# Altium schematic sheet Conn_A.SchDoc
size A1
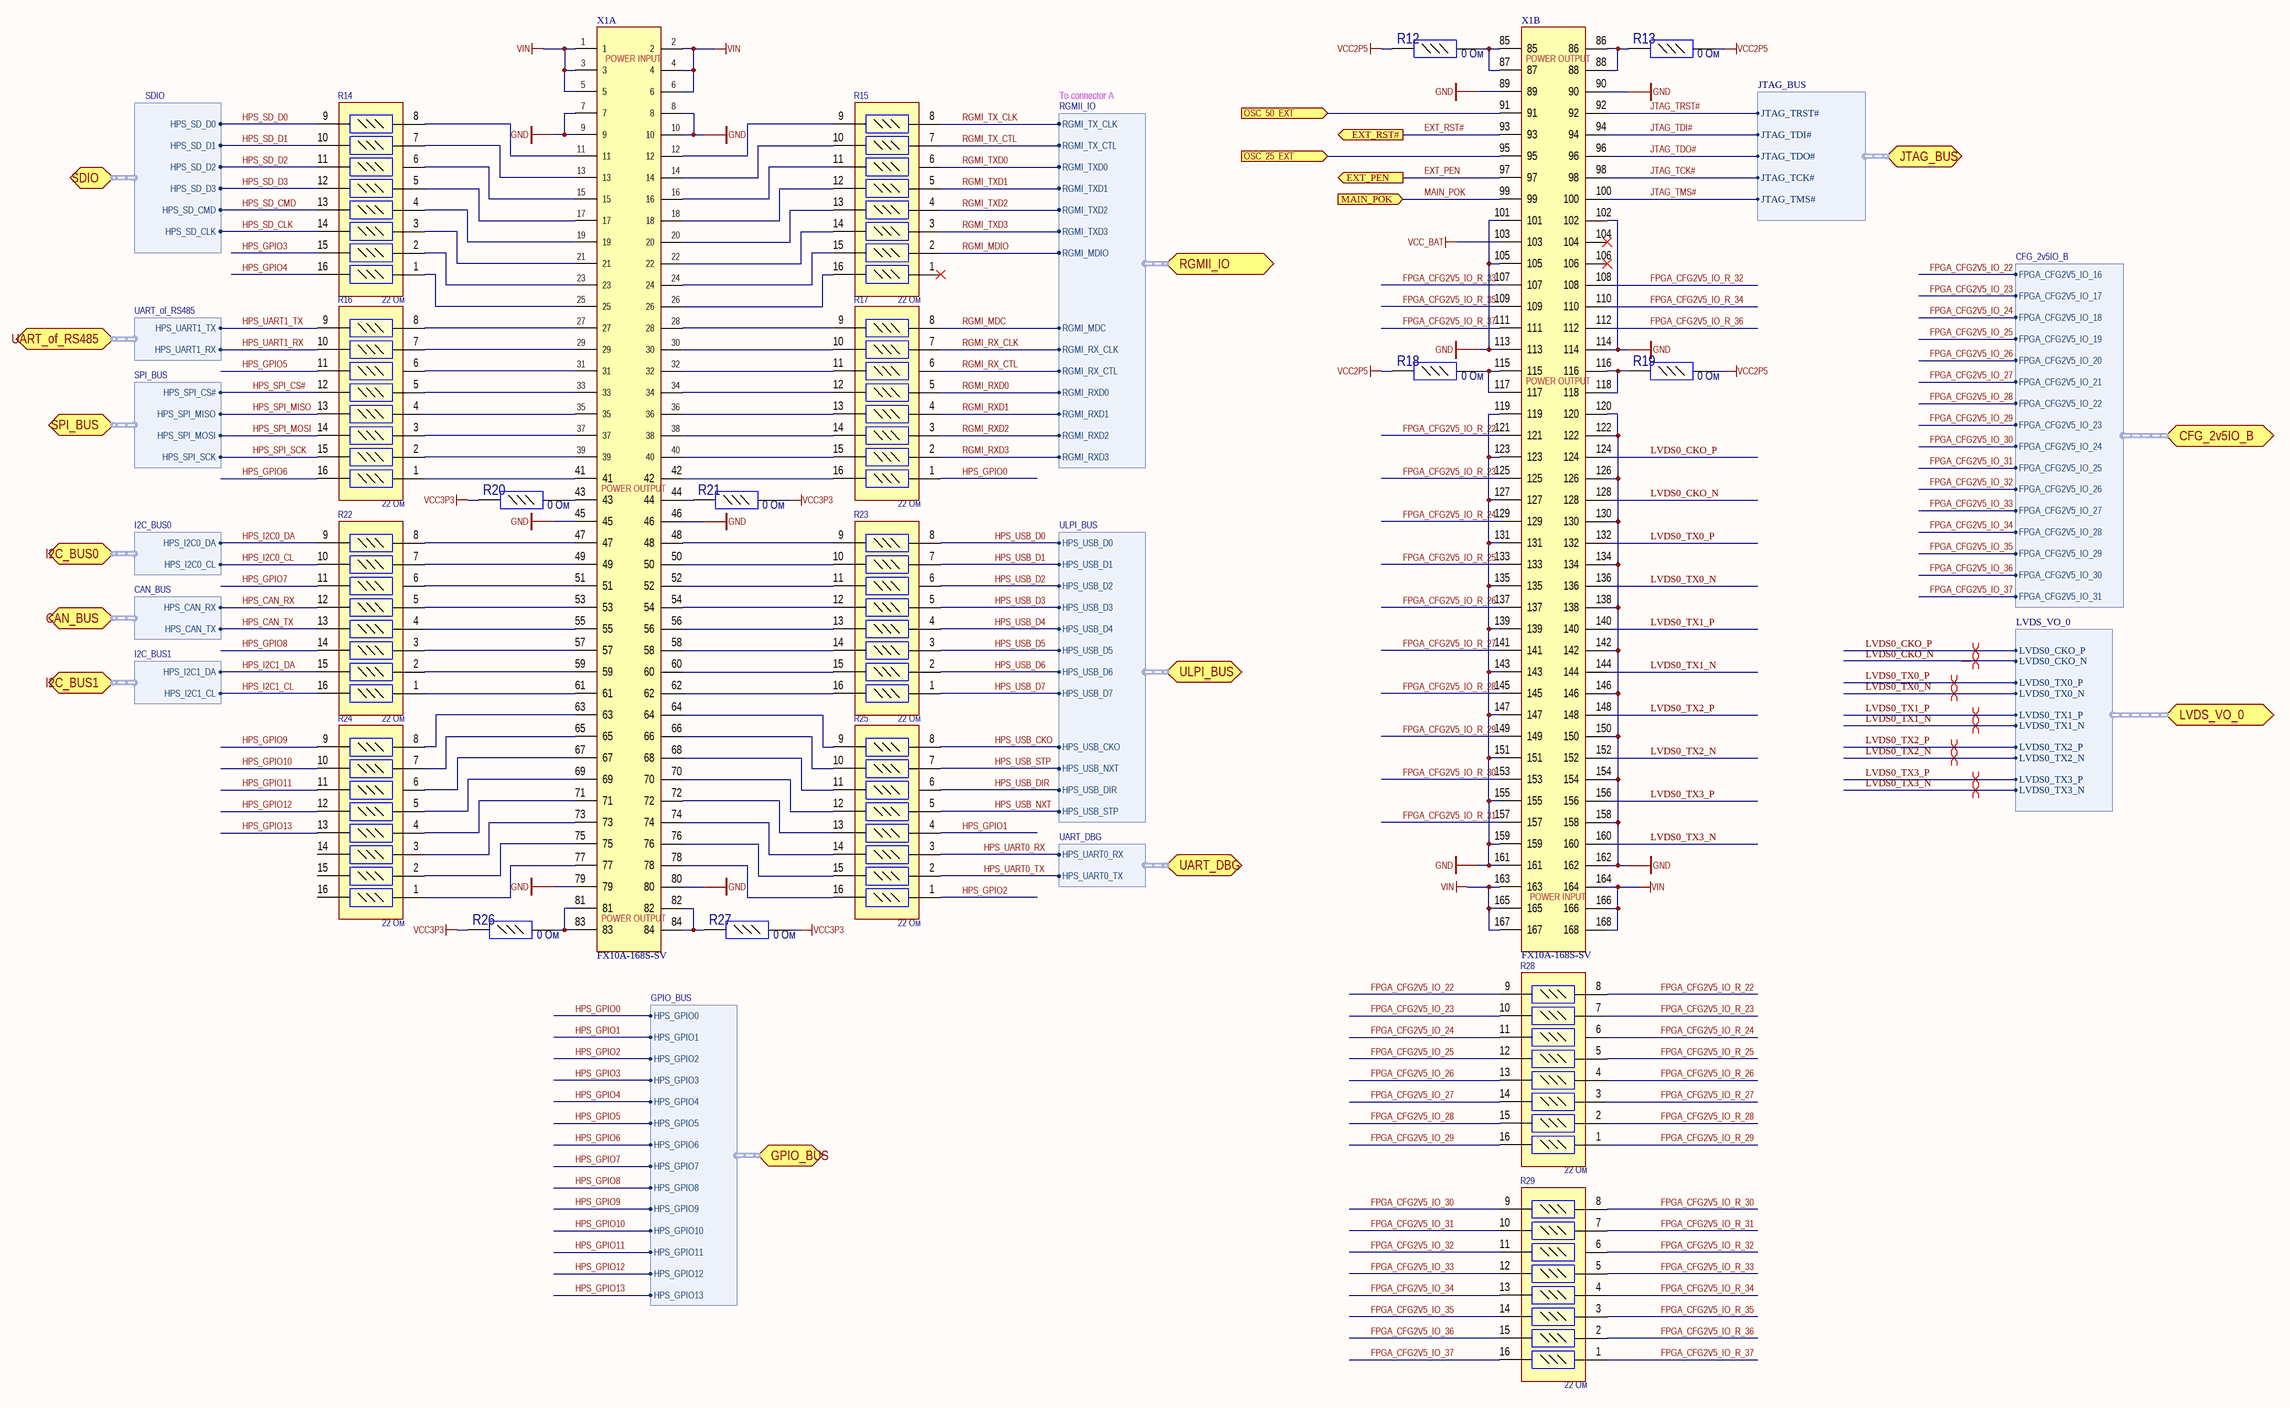
[diagram p0: Conn_A.SchDoc]

## Parts
R12  value 0 Ом  [CR0603]  (hidden comment: CR0603-0 Ом-±5%)
R13  value 0 Ом  [CR0603]  (hidden comment: CR0603-0 Ом-±5%)
R14  value 22 Ом  [CAT16-J8]  (hidden comment: YC248-JR-07-22 Ом)
R15  value 22 Ом  [CAT16-J8]  (hidden comment: YC248-JR-07-22 Ом)
R16  value 22 Ом  [CAT16-J8]  (hidden comment: YC248-JR-07-22 Ом)
R17  value 22 Ом  [CAT16-J8]  (hidden comment: YC248-JR-07-22 Ом)
R18  value 0 Ом  [CR0603]  (hidden comment: CR0603-0 Ом-±5%)
R19  value 0 Ом  [CR0603]  (hidden comment: CR0603-0 Ом-±5%)
R20  value 0 Ом  [CR0603]  (hidden comment: CR0603-0 Ом-±5%)
R21  value 0 Ом  [CR0603]  (hidden comment: CR0603-0 Ом-±5%)
R22  value 22 Ом  [CAT16-J8]  (hidden comment: YC248-JR-07-22 Ом)
R23  value 22 Ом  [CAT16-J8]  (hidden comment: YC248-JR-07-22 Ом)
R24  value 22 Ом  [CAT16-J8]  (hidden comment: YC248-JR-07-22 Ом)
R25  value 22 Ом  [CAT16-J8]  (hidden comment: YC248-JR-07-22 Ом)
R26  value 0 Ом  [CR0603]  (hidden comment: CR0603-0 Ом-±5%)
R27  value 0 Ом  [CR0603]  (hidden comment: CR0603-0 Ом-±5%)
R28  value 22 Ом  [CAT16-J8]  (hidden comment: YC248-JR-07-22 Ом)
R29  value 22 Ом  [CAT16-J8]  (hidden comment: YC248-JR-07-22 Ом)
X1  FX10A-168S-SV  [FX10A-168S-SV]  (parts A,B of 2)

## Ports
CAN_BUS (harness CAN_BUS), CFG_2v5IO_B (harness CFG_2v5IO_B), EXT_PEN (out), EXT_RST# (out), GPIO_BUS (harness GPIO_BUS), I2C_BUS0 (harness I2C_BUS0), I2C_BUS1 (harness I2C_BUS1), JTAG_BUS (harness JTAG_BUS), LVDS_VO_0 (harness LVDS_VO_0), MAIN_POK (in), OSC_25_EXT (in), OSC_50_EXT (in), RGMII_IO (harness RGMII_IO), SDIO (harness SDIO), SPI_BUS (harness SPI_BUS), UART_DBG (harness UART_DBG), UART_of_RS485 (harness UART_of_RS485), ULPI_BUS (harness ULPI_BUS)

## Harnesses
LVDS_VO_0: LVDS0_CKO_P, LVDS0_CKO_N, LVDS0_TX0_P, LVDS0_TX0_N, LVDS0_TX1_P, LVDS0_TX1_N, LVDS0_TX2_P, LVDS0_TX2_N, LVDS0_TX3_P, LVDS0_TX3_N
JTAG_BUS: JTAG_TRST#, JTAG_TDI#, JTAG_TDO#, JTAG_TCK#, JTAG_TMS#
SDIO: HPS_SD_D0, HPS_SD_D1, HPS_SD_D2, HPS_SD_D3, HPS_SD_CMD, HPS_SD_CLK
ULPI_BUS: HPS_USB_D0, HPS_USB_D1, HPS_USB_D2, HPS_USB_D3, HPS_USB_D4, HPS_USB_D5, HPS_USB_D6, HPS_USB_D7, HPS_USB_CKO, HPS_USB_NXT, HPS_USB_DIR, HPS_USB_STP
UART_DBG: HPS_UART0_RX, HPS_UART0_TX
UART_of_RS485: HPS_UART1_RX, HPS_UART1_TX
GPIO_BUS: HPS_GPIO0, HPS_GPIO1, HPS_GPIO2, HPS_GPIO3, HPS_GPIO4, HPS_GPIO5, HPS_GPIO6, HPS_GPIO7, HPS_GPIO8, HPS_GPIO9, HPS_GPIO10, HPS_GPIO11, HPS_GPIO12, HPS_GPIO13
SPI_BUS: HPS_SPI_MOSI, HPS_SPI_MISO, HPS_SPI_SCK, HPS_SPI_CS#
I2C_BUS0: HPS_I2C0_DA, HPS_I2C0_CL
I2C_BUS1: HPS_I2C1_DA, HPS_I2C1_CL
CAN_BUS: HPS_CAN_TX, HPS_CAN_RX
RGMII_IO: RGMI_TX_CLK, RGMI_TXD0, RGMI_TXD1, RGMI_TXD2, RGMI_TXD3, RGMI_RXD0, RGMI_RXD1, RGMI_RXD2, RGMI_RXD3, RGMI_TX_CTL, RGMI_RX_CTL, RGMI_RX_CLK, RGMI_MDIO, RGMI_MDC
CFG_2v5IO_B: FPGA_CFG2V5_IO_16, FPGA_CFG2V5_IO_17, FPGA_CFG2V5_IO_18, FPGA_CFG2V5_IO_19, FPGA_CFG2V5_IO_20, FPGA_CFG2V5_IO_21, FPGA_CFG2V5_IO_22, FPGA_CFG2V5_IO_23, FPGA_CFG2V5_IO_24, FPGA_CFG2V5_IO_25, FPGA_CFG2V5_IO_26, FPGA_CFG2V5_IO_27, FPGA_CFG2V5_IO_28, FPGA_CFG2V5_IO_29, FPGA_CFG2V5_IO_30, FPGA_CFG2V5_IO_31

## Nets
GND: X1.7 X1.8 X1.9 X1.10 X1.45 X1.46 X1.79 X1.80 X1.89 X1.90 X1.101 X1.102 X1.105 X1.113 X1.114 X1.119 X1.120 X1.122 X1.123 X1.126 X1.127 X1.130 X1.131 X1.134 X1.135 X1.138 X1.139 X1.142 X1.143 X1.146 X1.147 X1.150 X1.151 X1.154 X1.155 X1.158 X1.159 X1.161 X1.162
VCC2P5: R12.1(+) R13.2(-) R18.1(+) R19.2(-)
VCC3P3: R20.1(+) R21.2(-) R26.1(+) R27.2(-)
VCC_BAT: X1.103
VIN: X1.1 X1.2 X1.3 X1.4 X1.5 X1.6 X1.163 X1.164 X1.165 X1.166 X1.167 X1.168
EXT_PEN: X1.97 ; port EXT_PEN
EXT_RST#: X1.93 ; port EXT_RST#
FPGA_CFG2V5_IO_22: R28.9 ; port CFG_2v5IO_B.FPGA_CFG2V5_IO_16
FPGA_CFG2V5_IO_23: R28.10 ; port CFG_2v5IO_B.FPGA_CFG2V5_IO_17
FPGA_CFG2V5_IO_24: R28.11 ; port CFG_2v5IO_B.FPGA_CFG2V5_IO_18
FPGA_CFG2V5_IO_25: R28.12 ; port CFG_2v5IO_B.FPGA_CFG2V5_IO_19
FPGA_CFG2V5_IO_26: R28.13 ; port CFG_2v5IO_B.FPGA_CFG2V5_IO_20
FPGA_CFG2V5_IO_27: R28.14 ; port CFG_2v5IO_B.FPGA_CFG2V5_IO_21
FPGA_CFG2V5_IO_28: R28.15 ; port CFG_2v5IO_B.FPGA_CFG2V5_IO_22
FPGA_CFG2V5_IO_29: R28.16 ; port CFG_2v5IO_B.FPGA_CFG2V5_IO_23
FPGA_CFG2V5_IO_30: R29.9 ; port CFG_2v5IO_B.FPGA_CFG2V5_IO_24
FPGA_CFG2V5_IO_31: R29.10 ; port CFG_2v5IO_B.FPGA_CFG2V5_IO_25
FPGA_CFG2V5_IO_32: R29.11 ; port CFG_2v5IO_B.FPGA_CFG2V5_IO_26
FPGA_CFG2V5_IO_33: R29.12 ; port CFG_2v5IO_B.FPGA_CFG2V5_IO_27
FPGA_CFG2V5_IO_34: R29.13 ; port CFG_2v5IO_B.FPGA_CFG2V5_IO_28
FPGA_CFG2V5_IO_35: R29.14 ; port CFG_2v5IO_B.FPGA_CFG2V5_IO_29
FPGA_CFG2V5_IO_36: R29.15 ; port CFG_2v5IO_B.FPGA_CFG2V5_IO_30
FPGA_CFG2V5_IO_37: R29.16 ; port CFG_2v5IO_B.FPGA_CFG2V5_IO_31
FPGA_CFG2V5_IO_R_22: R28.8 X1.121
FPGA_CFG2V5_IO_R_23: R28.7 X1.125
FPGA_CFG2V5_IO_R_24: R28.6 X1.129
FPGA_CFG2V5_IO_R_25: R28.5 X1.133
FPGA_CFG2V5_IO_R_26: R28.4 X1.137
FPGA_CFG2V5_IO_R_27: R28.3 X1.141
FPGA_CFG2V5_IO_R_28: R28.2 X1.145
FPGA_CFG2V5_IO_R_29: R28.1 X1.149
FPGA_CFG2V5_IO_R_30: R29.8 X1.153
FPGA_CFG2V5_IO_R_31: R29.7 X1.157
FPGA_CFG2V5_IO_R_32: R29.6 X1.108
FPGA_CFG2V5_IO_R_33: R29.5 X1.107
FPGA_CFG2V5_IO_R_34: R29.4 X1.110
FPGA_CFG2V5_IO_R_35: R29.3 X1.109
FPGA_CFG2V5_IO_R_36: R29.2 X1.112
FPGA_CFG2V5_IO_R_37: R29.1 X1.111
HPS_CAN_RX: R22.12 ; port CAN_BUS.HPS_CAN_RX
HPS_CAN_TX: R22.13 ; port CAN_BUS.HPS_CAN_TX
HPS_GPIO0: R17.1 ; port GPIO_BUS.HPS_GPIO0
HPS_GPIO1: R25.4 ; port GPIO_BUS.HPS_GPIO1
HPS_GPIO2: R25.1 ; port GPIO_BUS.HPS_GPIO2
HPS_GPIO3: R14.15 ; port GPIO_BUS.HPS_GPIO3
HPS_GPIO4: R14.16 ; port GPIO_BUS.HPS_GPIO4
HPS_GPIO5: R16.11 ; port GPIO_BUS.HPS_GPIO5
HPS_GPIO6: R16.16 ; port GPIO_BUS.HPS_GPIO6
HPS_GPIO7: R22.11 ; port GPIO_BUS.HPS_GPIO7
HPS_GPIO8: R22.14 ; port GPIO_BUS.HPS_GPIO8
HPS_GPIO9: R24.9 ; port GPIO_BUS.HPS_GPIO9
HPS_GPIO10: R24.10 ; port GPIO_BUS.HPS_GPIO10
HPS_GPIO11: R24.11 ; port GPIO_BUS.HPS_GPIO11
HPS_GPIO12: R24.12 ; port GPIO_BUS.HPS_GPIO12
HPS_GPIO13: R24.13 ; port GPIO_BUS.HPS_GPIO13
HPS_I2C0_CL: R22.10 ; port I2C_BUS0.HPS_I2C0_CL
HPS_I2C0_DA: R22.9 ; port I2C_BUS0.HPS_I2C0_DA
HPS_I2C1_CL: R22.16 ; port I2C_BUS1.HPS_I2C1_CL
HPS_I2C1_DA: R22.15 ; port I2C_BUS1.HPS_I2C1_DA
HPS_SD_CLK: R14.14 ; port SDIO.HPS_SD_CLK
HPS_SD_CMD: R14.13 ; port SDIO.HPS_SD_CMD
HPS_SD_D0: R14.9 ; port SDIO.HPS_SD_D0
HPS_SD_D1: R14.10 ; port SDIO.HPS_SD_D1
HPS_SD_D2: R14.11 ; port SDIO.HPS_SD_D2
HPS_SD_D3: R14.12 ; port SDIO.HPS_SD_D3
HPS_SPI_CS#: R16.12 ; port SPI_BUS.HPS_SPI_CS#
HPS_SPI_MISO: R16.13 ; port SPI_BUS.HPS_SPI_MISO
HPS_SPI_MOSI: R16.14 ; port SPI_BUS.HPS_SPI_MOSI
HPS_SPI_SCK: R16.15 ; port SPI_BUS.HPS_SPI_SCK
HPS_UART0_RX: R25.3 ; port UART_DBG.HPS_UART0_RX
HPS_UART0_TX: R25.2 ; port UART_DBG.HPS_UART0_TX
HPS_UART1_RX: R16.10 ; port UART_of_RS485.HPS_UART1_RX
HPS_UART1_TX: R16.9 ; port UART_of_RS485.HPS_UART1_TX
HPS_USB_CKO: R25.8 ; port ULPI_BUS.HPS_USB_CKO
HPS_USB_D0: R23.8 ; port ULPI_BUS.HPS_USB_D0
HPS_USB_D1: R23.7 ; port ULPI_BUS.HPS_USB_D1
HPS_USB_D2: R23.6 ; port ULPI_BUS.HPS_USB_D2
HPS_USB_D3: R23.5 ; port ULPI_BUS.HPS_USB_D3
HPS_USB_D4: R23.4 ; port ULPI_BUS.HPS_USB_D4
HPS_USB_D5: R23.3 ; port ULPI_BUS.HPS_USB_D5
HPS_USB_D6: R23.2 ; port ULPI_BUS.HPS_USB_D6
HPS_USB_D7: R23.1 ; port ULPI_BUS.HPS_USB_D7
HPS_USB_DIR: R25.6 ; port ULPI_BUS.HPS_USB_DIR
HPS_USB_NXT: R25.5 ; port ULPI_BUS.HPS_USB_STP
HPS_USB_STP: R25.7 ; port ULPI_BUS.HPS_USB_NXT
JTAG_TCK#: X1.98 ; port JTAG_BUS.JTAG_TCK#
JTAG_TDI#: X1.94 ; port JTAG_BUS.JTAG_TDI#
JTAG_TDO#: X1.96 ; port JTAG_BUS.JTAG_TDO#
JTAG_TMS#: X1.100 ; port JTAG_BUS.JTAG_TMS#
JTAG_TRST#: X1.92 ; port JTAG_BUS.JTAG_TRST#
LVDS0_CKO_N: X1.128 ; port LVDS_VO_0.LVDS0_CKO_N
LVDS0_CKO_P: X1.124 ; port LVDS_VO_0.LVDS0_CKO_P
LVDS0_TX0_N: X1.136 ; port LVDS_VO_0.LVDS0_TX0_N
LVDS0_TX0_P: X1.132 ; port LVDS_VO_0.LVDS0_TX0_P
LVDS0_TX1_N: X1.144 ; port LVDS_VO_0.LVDS0_TX1_N
LVDS0_TX1_P: X1.140 ; port LVDS_VO_0.LVDS0_TX1_P
LVDS0_TX2_N: X1.152 ; port LVDS_VO_0.LVDS0_TX2_N
LVDS0_TX2_P: X1.148 ; port LVDS_VO_0.LVDS0_TX2_P
LVDS0_TX3_N: X1.160 ; port LVDS_VO_0.LVDS0_TX3_N
LVDS0_TX3_P: X1.156 ; port LVDS_VO_0.LVDS0_TX3_P
MAIN_POK: X1.99 ; port MAIN_POK
OSC_25_EXT: X1.95 ; port OSC_25_EXT
OSC_50_EXT: X1.91 ; port OSC_50_EXT
RGMI_MDC: R17.8 ; port RGMII_IO.RGMI_MDC
RGMI_MDIO: R15.2 ; port RGMII_IO.RGMI_MDIO
RGMI_RX_CLK: R17.7 ; port RGMII_IO.RGMI_RX_CLK
RGMI_RX_CTL: R17.6 ; port RGMII_IO.RGMI_RX_CTL
RGMI_RXD0: R17.5 ; port RGMII_IO.RGMI_RXD0
RGMI_RXD1: R17.4 ; port RGMII_IO.RGMI_RXD1
RGMI_RXD2: R17.3 ; port RGMII_IO.RGMI_RXD2
RGMI_RXD3: R17.2 ; port RGMII_IO.RGMI_RXD3
RGMI_TX_CLK: R15.8 ; port RGMII_IO.RGMI_TX_CLK
RGMI_TX_CTL: R15.7 ; port RGMII_IO.RGMI_TX_CTL
RGMI_TXD0: R15.6 ; port RGMII_IO.RGMI_TXD0
RGMI_TXD1: R15.5 ; port RGMII_IO.RGMI_TXD1
RGMI_TXD2: R15.4 ; port RGMII_IO.RGMI_TXD2
RGMI_TXD3: R15.3 ; port RGMII_IO.RGMI_TXD3
NetR12_2: R12.2(-) X1.85 X1.87
NetR13_1: R13.1(+) X1.86 X1.88
NetR14_1: R14.1 X1.25
NetR14_2: R14.2 X1.23
NetR14_3: R14.3 X1.21
NetR14_4: R14.4 X1.19
NetR14_5: R14.5 X1.17
NetR14_6: R14.6 X1.15
NetR14_7: R14.7 X1.13
NetR14_8: R14.8 X1.11
NetR15_9: R15.9 X1.12
NetR15_10: R15.10 X1.14
NetR15_11: R15.11 X1.16
NetR15_12: R15.12 X1.18
NetR15_13: R15.13 X1.20
NetR15_14: R15.14 X1.22
NetR15_15: R15.15 X1.24
NetR15_16: R15.16 X1.26
NetR16_1: R16.1 X1.41
NetR16_2: R16.2 X1.39
NetR16_3: R16.3 X1.37
NetR16_4: R16.4 X1.35
NetR16_5: R16.5 X1.33
NetR16_6: R16.6 X1.31
NetR16_7: R16.7 X1.29
NetR16_8: R16.8 X1.27
NetR17_9: R17.9 X1.28
NetR17_10: R17.10 X1.30
NetR17_11: R17.11 X1.32
NetR17_12: R17.12 X1.34
NetR17_13: R17.13 X1.36
NetR17_14: R17.14 X1.38
NetR17_15: R17.15 X1.40
NetR17_16: R17.16 X1.42
NetR18_2: R18.2(-) X1.115 X1.117
NetR19_1: R19.1(+) X1.116 X1.118
NetR20_2: R20.2(-) X1.43
NetR21_1: R21.1(+) X1.44
NetR22_1: R22.1 X1.61
NetR22_2: R22.2 X1.59
NetR22_3: R22.3 X1.57
NetR22_4: R22.4 X1.55
NetR22_5: R22.5 X1.53
NetR22_6: R22.6 X1.51
NetR22_7: R22.7 X1.49
NetR22_8: R22.8 X1.47
NetR23_9: R23.9 X1.48
NetR23_10: R23.10 X1.50
NetR23_11: R23.11 X1.52
NetR23_12: R23.12 X1.54
NetR23_13: R23.13 X1.56
NetR23_14: R23.14 X1.58
NetR23_15: R23.15 X1.60
NetR23_16: R23.16 X1.62
NetR24_1: R24.1 X1.77
NetR24_2: R24.2 X1.75
NetR24_3: R24.3 X1.73
NetR24_4: R24.4 X1.71
NetR24_5: R24.5 X1.69
NetR24_6: R24.6 X1.67
NetR24_7: R24.7 X1.65
NetR24_8: R24.8 X1.63
NetR25_9: R25.9 X1.64
NetR25_10: R25.10 X1.66
NetR25_11: R25.11 X1.68
NetR25_12: R25.12 X1.70
NetR25_13: R25.13 X1.72
NetR25_14: R25.14 X1.74
NetR25_15: R25.15 X1.76
NetR25_16: R25.16 X1.78
NetR26_2: R26.2(-) X1.81 X1.83
NetR27_1: R27.1(+) X1.82 X1.84

Not connected (* = marked no-connect by the designer): R15 1*; R24 14 15 16; X1 104* 106*

## Layout directives
differential pair: LVDS0_CKO_N, LVDS0_CKO_P, LVDS0_TX0_N, LVDS0_TX0_P, LVDS0_TX1_N, LVDS0_TX1_P, LVDS0_TX2_N, LVDS0_TX2_P, LVDS0_TX3_N, LVDS0_TX3_P

## Notes on the sheet
- (near X1) POWER INPUT
- To connector A
- (near X1) POWER OUTPUT

## Library data of the parts
R12 R13 R18-R21 R26 R27 = CR0603-#-±5%: Чип резистор
R14-R17 R22-R25 R28 R29 = YC248-JR-07-#: Набор чип резисторов; P: 0.062 Вт; Supplier 1: Digi-Key; Supplier Part Number 1: YC248-JR-0722RL